# EasyEDA Pro project PID项目.eprj

# Schematic PID项目
Board Name: PID项目; Create Date: 2025-08-23
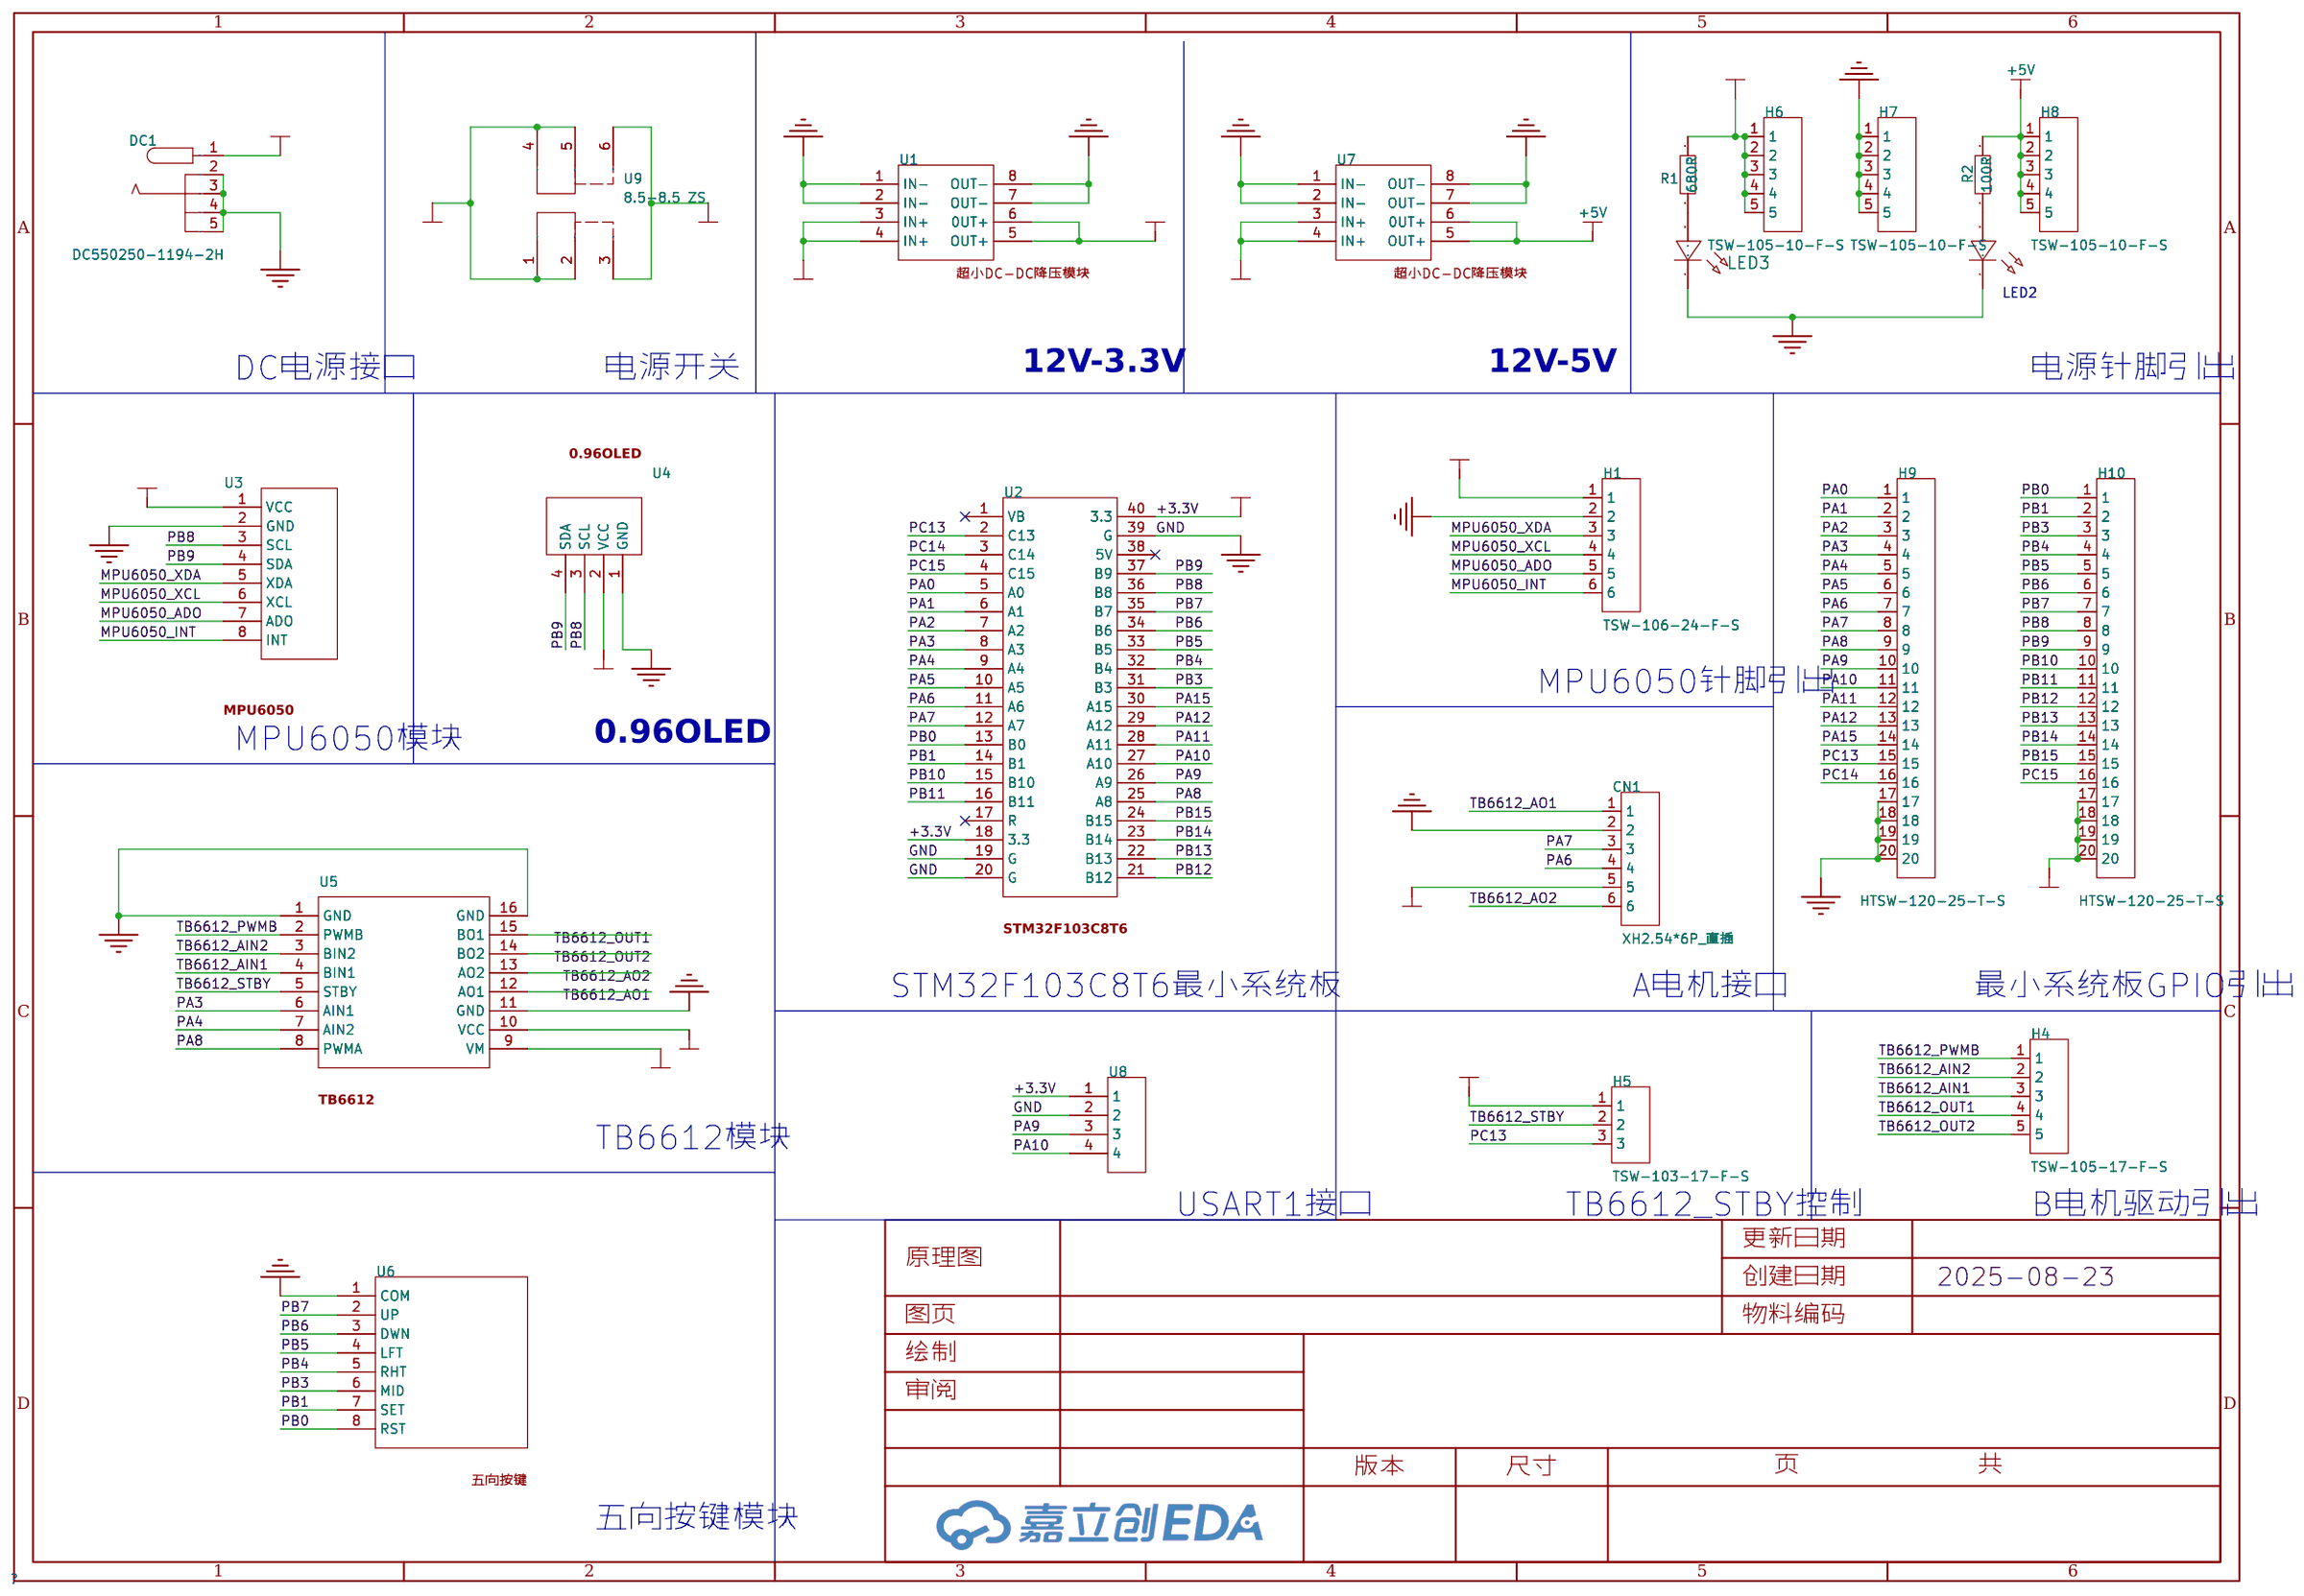
[diagram p0: schematic sheet]

## Parts
CN1  XH2.54*6P_直插  [CONN-TH_XH2.54-6P]
DC1  DC550250-1194-2H  [DC-IN-TH_DC550250-1194-2H]
H1  TSW-106-24-F-S  [HDR-TH_MTSW-106-07-L-S-220]
H4  TSW-105-17-F-S  [HDR-TH_5P-P2.54_HTSW-105-08-F-S]
H5  TSW-103-17-F-S  [HDR-TH_3P-P2.54_HTSW-103-14-TM-S]
H6  TSW-105-10-F-S  [HDR-TH_5P-P2.54_HTSW-105-08-F-S]
H7  TSW-105-10-F-S  [HDR-TH_5P-P2.54_HTSW-105-08-F-S]
H8  TSW-105-10-F-S  [HDR-TH_5P-P2.54_HTSW-105-08-F-S]
H9  HTSW-120-25-T-S  [HDR-TH_TSW-120-22-L-S]
H10  HTSW-120-25-T-S  [HDR-TH_TSW-120-22-L-S]
LED2  -  [LED_0805]
LED3  -  [LED_0805]
R1  680R  [R0805]
R2  100R  [R0805]
U1  -  [12V-3.3V]
U2  -  [F103C8T6]
U3  -  [MPU6050]
U4  -  [0.96OLED]
U5  -  [电机驱动]
U6  -  [五向按键]
U7  -  [12V-3.3V]
U8  -  [1x4]
U9  8.5-8.5 ZS  [SW-TH_6P-L8.5-W8.5-P2.50_8.5-8.5-ZS]

## Library data of the parts
CN1 = XH2.54*6P_直插: Supplier Part: C9900008614; Supplier Footprint: XH2.54_6P; JLCPCB Part Class: 扩展库; Supplier: LCSC
DC1 = DC550250-1194-2H: Supplier Part: C7428742; Manufacturer: HDGC(华德共创); Supplier Footprint: SMD; Datasheet: https://item.szlcsc.com/datasheet/DC550250-1194-2H/8424489.html; Supplier: LCSC; Connector Type: DC电源插座
H1 = TSW-106-24-F-S: LCSC Part Name: 间距:2.54mm 直插; Supplier Part: C7366187; Manufacturer: SAMTEC; Supplier Footprint: 插件,P=2.54mm; JLCPCB Part Class: 扩展库; Datasheet: https://item.szlcsc.com/datasheet/TSW-106-24-F-S/8337024.html; Supplier: LCSC; Pitch: 2.54mm; Mounting Type: 直插; Number of Rows: 单排; Number of Pins: 6P; Contact Material: 磷青铜; Contact Plating: 锡; Operating Temperature: -55℃~+125℃; Color: 黑色
H4 = TSW-105-17-F-S: LCSC Part Name: 间距:2.54mm 直插; Supplier Part: C7366066; Manufacturer: SAMTEC; Supplier Footprint: 插件,P=2.54mm; JLCPCB Part Class: 扩展库; Datasheet: https://item.szlcsc.com/datasheet/TSW-105-17-F-S/8336902.html; Supplier: LCSC; Pitch: 2.54mm; Mounting Type: 直插; Number of Rows: 单排; Number of Pins: 5P; Contact Material: 磷青铜; Contact Plating: 锡; Operating Temperature: -55℃~+125℃; Color: 黑色
H5 = TSW-103-17-F-S: LCSC Part Name: 间距:2.54mm 直插; Supplier Part: C6561475; Manufacturer: SAMTEC; Supplier Footprint: 插件,P=2.54mm; JLCPCB Part Class: 扩展库; Datasheet: https://item.szlcsc.com/datasheet/TSW-103-17-F-S/7515405.html; Supplier: LCSC; Pitch: 2.54mm; Mounting Type: 直插; Number of Rows: 单排; Number of Pins: 3P; Contact Material: 磷青铜; Contact Plating: 锡; Operating Temperature: -55℃~+125℃; Color: 黑色
H6-H8 = TSW-105-10-F-S: LCSC Part Name: 间距:2.54mm 直插; Supplier Part: C7128842; Manufacturer: SAMTEC; Supplier Footprint: 插件,P=2.54mm; JLCPCB Part Class: 扩展库; Datasheet: https://item.szlcsc.com/datasheet/TSW-105-10-F-S/8095648.html; Supplier: LCSC; Pitch: 2.54mm; Mounting Type: 直插; Number of Rows: 单排; Number of Pins: 5P; Contact Material: 磷青铜; Contact Plating: 锡; Operating Temperature: -55℃~+125℃; Color: 黑色
H9 H10 = HTSW-120-25-T-S: LCSC Part Name: 间距:2.54mm 直插; Supplier Part: C6637971; Manufacturer: SAMTEC; Supplier Footprint: 插件,P=2.54mm; JLCPCB Part Class: 扩展库; Datasheet: https://item.szlcsc.com/datasheet/HTSW-120-25-T-S/7592945.html; Supplier: LCSC; Pitch: 2.54mm; Mounting Type: 直插; Number of Rows: 单排; Number of Pins: 20P; Contact Material: 磷青铜; Contact Plating: 锡; Operating Temperature: -55℃~+105℃
LED2 = LED_0805-G: Supplier Footprint: 0805
LED3 = LED_0805-R: Supplier Footprint: 0805
R1 R2 = Res_0805: Supplier Footprint: 0805
U1 U7 = 12V-3.3V
U2 = f103c8t6
U3 = MPU6050
U4 = 0.96OLED
U5 = 电机驱动
U6 = 五向按键
U8 = 1x4
U9 = 8.5-8.5 ZS: LCSC Part Name: 按键开关8.5x8.5 自锁高头 180gf; Supplier Part: C5379895; Manufacturer: SHOU HAN(首韩); Supplier Footprint: 插件; JLCPCB Part Class: 扩展库; Datasheet: https://atta.szlcsc.com/upload/public/pdf/source/20250421/740778E17D84A853554121E0B172E787.pdf; Supplier: LCSC; Circuit: 双刀双掷; Self Lock / No Lock: 自锁; Actuator Style: 矩形柱塞; Mounting Type: 直插; Contact Current: 100mA; Voltage Rating: 30V; Actuator/Cap Color: 蓝色; With Lamp: 不带; Termination Style: PC引脚; Operating Force: 1.8N; Operating Temperature: -10℃~+70℃; Life: 5千次

## Nets
+3.3V: CN1.5 H1.1 H5.1 H10.17 H10.18 H10.19 H10.20 U1.5(OUT+) U1.6(0UT+) U2.18(3.3) U2.40(3.3) U3.1(VCC) U4.2(VCC) U5.10(VCC) U8.1
+5V: H8.1 H8.2 H8.3 H8.4 H8.5 R2.2 U7.5(OUT+) U7.6(0UT+)
+12V: H6.1 H6.2 H6.3 H6.4 H6.5 R1.1 U1.3(IN+) U1.4(IN+) U5.9(VM) U7.3(IN+) U7.4(IN+) U9.3 U9.6
GND: CN1.2 DC1.2(-) DC1.3(-) DC1.4(-) DC1.5(-) H1.2 H7.1 H7.2 H7.3 H7.4 H7.5 H9.17 H9.18 H9.19 H9.20 LED2.1(C) LED3.1(C) U1.1(IN-) U1.2(IN-) U1.7(OUT-) U1.8(OUT-) U2.19(G) U2.20(G) U2.39(G) U3.2(GND) U4.1(GND) U5.1(GND) U5.11(GND) U5.16(GND) U6.1(COM) U7.1(IN-) U7.2(IN-) U7.7(OUT-) U7.8(OUT-) U8.2
IN+12V: DC1.1(+) U9.1 U9.2 U9.4 U9.5
MPU6050_ADO: H1.5 U3.7(ADO)
MPU6050_INT: H1.6 U3.8(INT)
MPU6050_XCL: H1.4 U3.6(XCL)
MPU6050_XDA: H1.3 U3.5(XDA)
PA0: H9.1 U2.5(A0)
PA1: H9.2 U2.6(A1)
PA2: H9.3 U2.7(A2)
PA3: H9.4 U2.8(A3) U5.6(AIN1)
PA4: H9.5 U2.9(A4) U5.7(AIN2)
PA5: H9.6 U2.10(A5)
PA6: CN1.4 H9.7 U2.11(A6)
PA7: CN1.3 H9.8 U2.12(A7)
PA8: H9.9 U2.25(A8) U5.8(PWMA)
PA9: H9.10 U2.26(A9) U8.3
PA10: H9.11 U2.27(A10) U8.4
PA11: H9.12 U2.28(A11)
PA12: H9.13 U2.29(A12)
PA15: H9.14 U2.30(A15)
PB0: H10.1 U2.13(B0) U6.8(RST)
PB1: H10.2 U2.14(B1) U6.7(SET)
PB3: H10.3 U2.31(B3) U6.6(MID)
PB4: H10.4 U2.32(B4) U6.5(RHT)
PB5: H10.5 U2.33(B5) U6.4(LFT)
PB6: H10.6 U2.34(B6) U6.3(DWN)
PB7: H10.7 U2.35(B7) U6.2(UP)
PB8: H10.8 U2.36(B8) U3.3(SCL) U4.3(SCL)
PB9: H10.9 U2.37(B9) U3.4(SDA) U4.4(SDA)
PB10: H10.10 U2.15(B10)
PB11: H10.11 U2.16(B11)
PB12: H10.12 U2.21(B12)
PB13: H10.13 U2.22(B13)
PB14: H10.14 U2.23(B14)
PB15: H10.15 U2.24(B15)
PC13: H5.3 H9.15 U2.2(C13)
PC14: H9.16 U2.3(C14)
PC15: H10.16 U2.4(C15)
TB6612_AIN1: H4.3 U5.4(BIN1)
TB6612_AIN2: H4.2 U5.3(BIN2)
TB6612_AO1: CN1.1 U5.12(AO1)
TB6612_AO2: CN1.6 U5.13(AO2)
TB6612_OUT1: H4.4 U5.15(BO1)
TB6612_OUT2: H4.5 U5.14(BO2)
TB6612_PWMB: H4.1 U5.2(PWMB)
TB6612_STBY: H5.2 U5.5(STBY)
$1N9714: LED2.2(A) R2.1
$1N10386: LED3.2(A) R1.2

Not connected (* = marked no-connect by the designer): U2 1(VB)* 17(R)* 38(5V)*

## Notes on the sheet
- DC电源接口
- 电源开关
- 12V-3.3V
- 12V-5V
- 电源针脚引出
- MPU6050针脚引出
- MPU6050模块
- 0.96OLED
- STM32F103C8T6最小系统板
- A电机接口
- 最小系统板GPIO引出
- TB6612模块
- USART1接口
- TB6612_STBY控制
- B电机驱动引出
- 五向按键模块

# Board PID项目
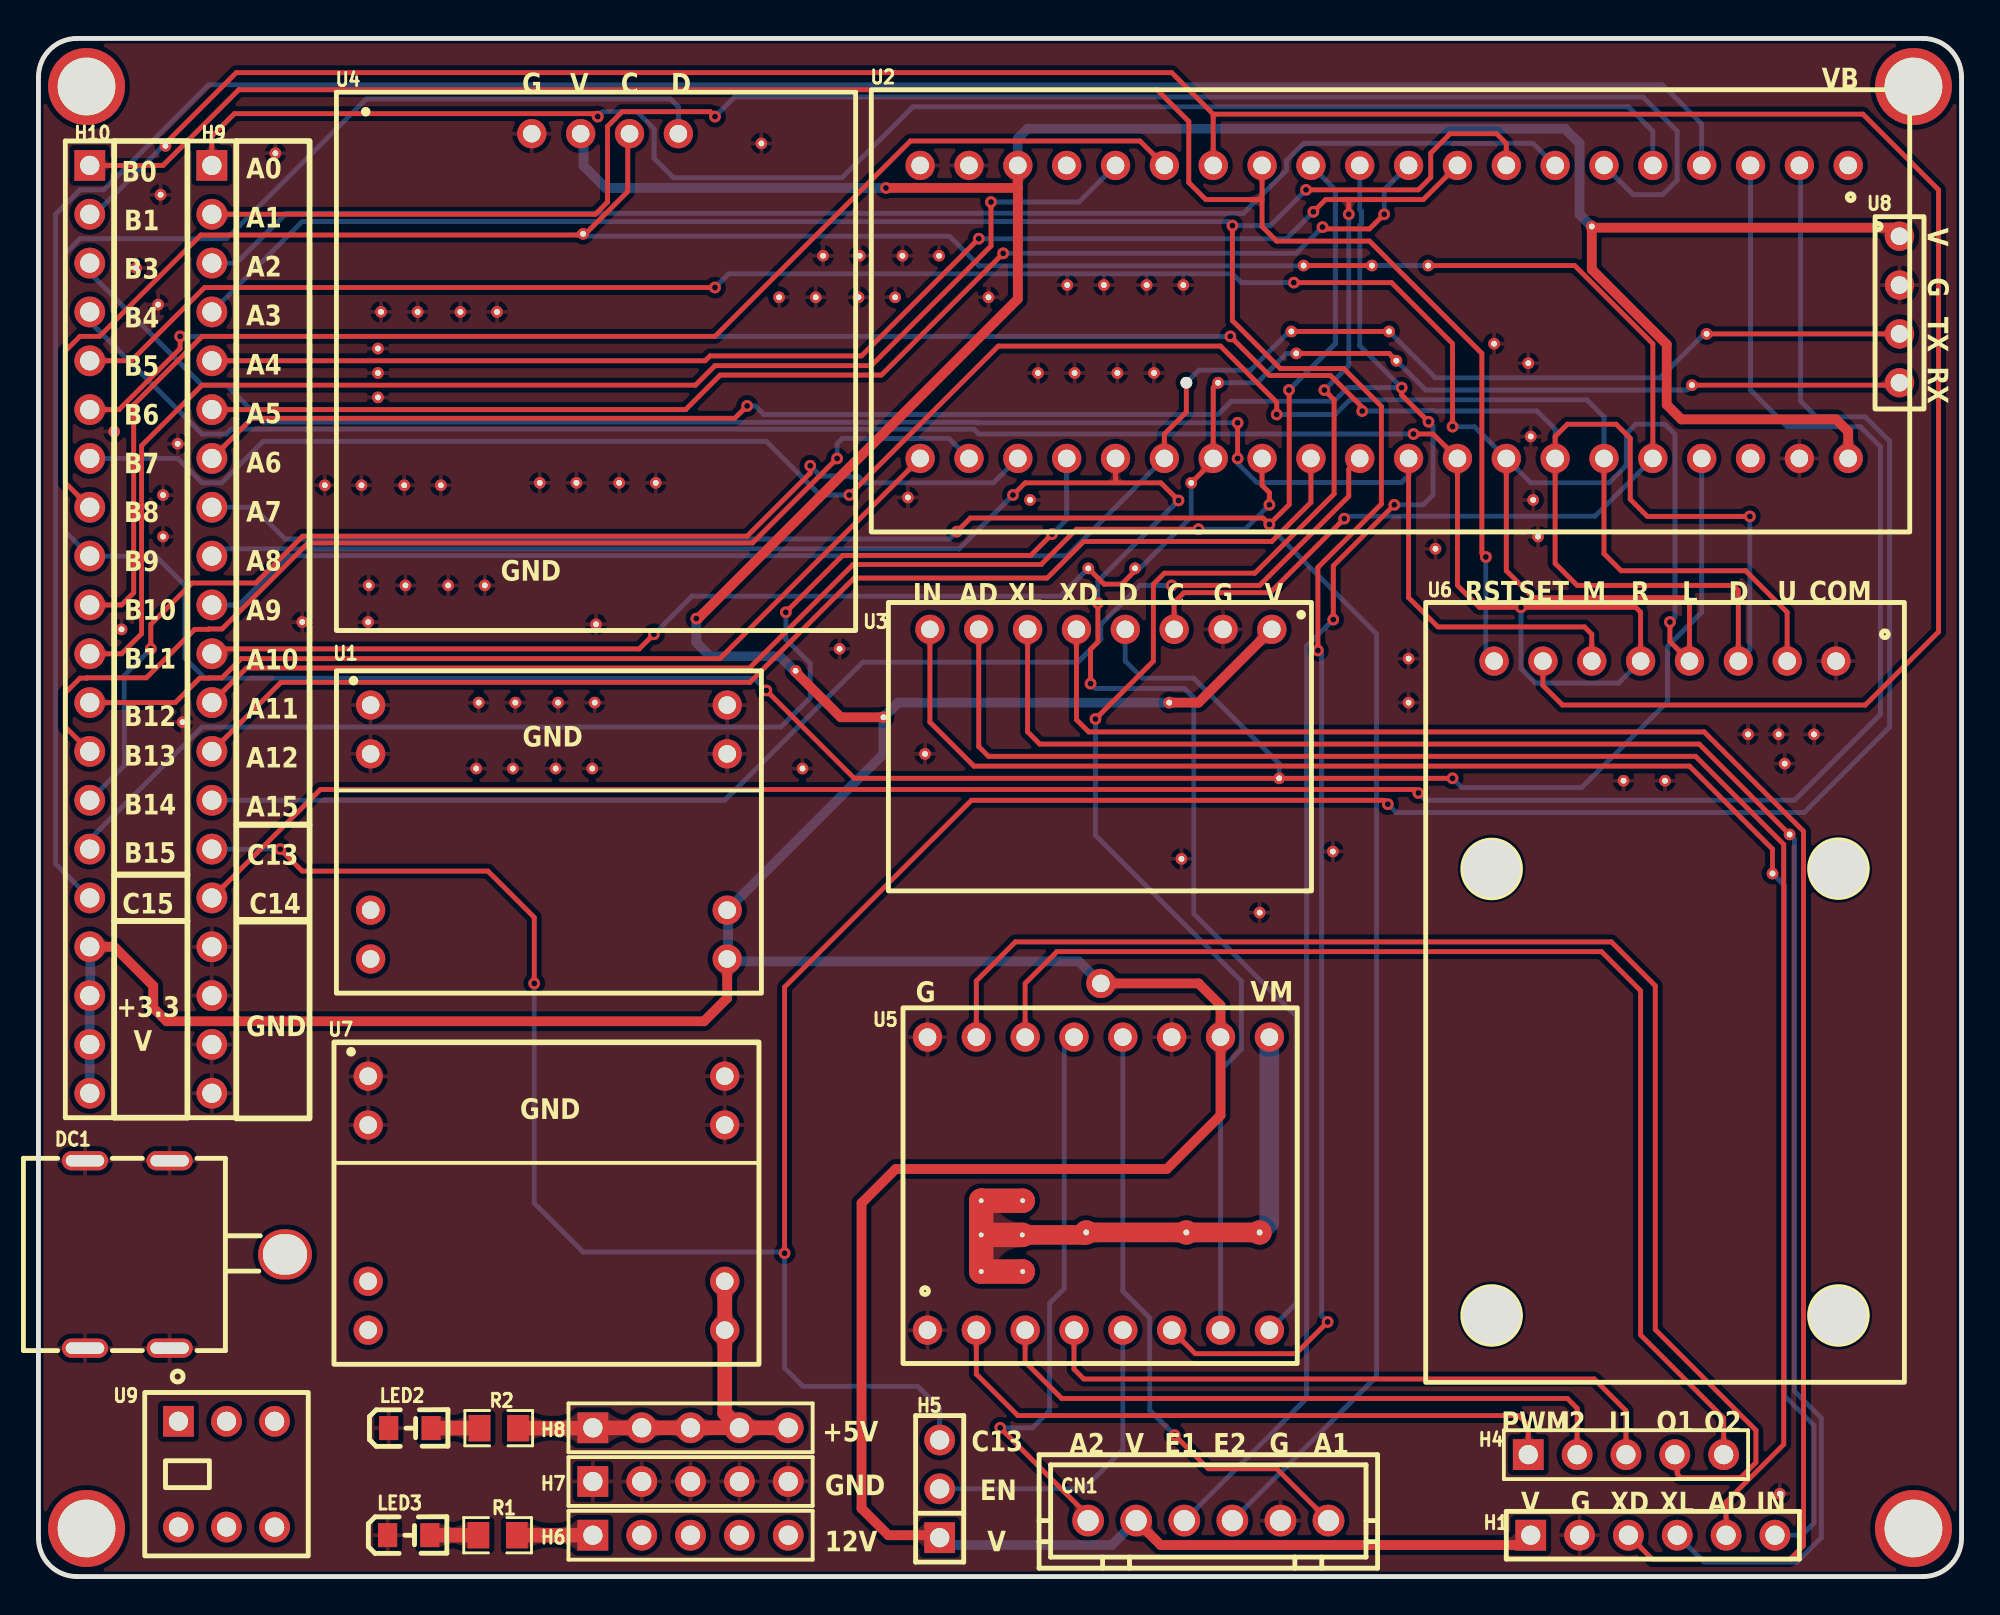
[diagram p1: board, top side]
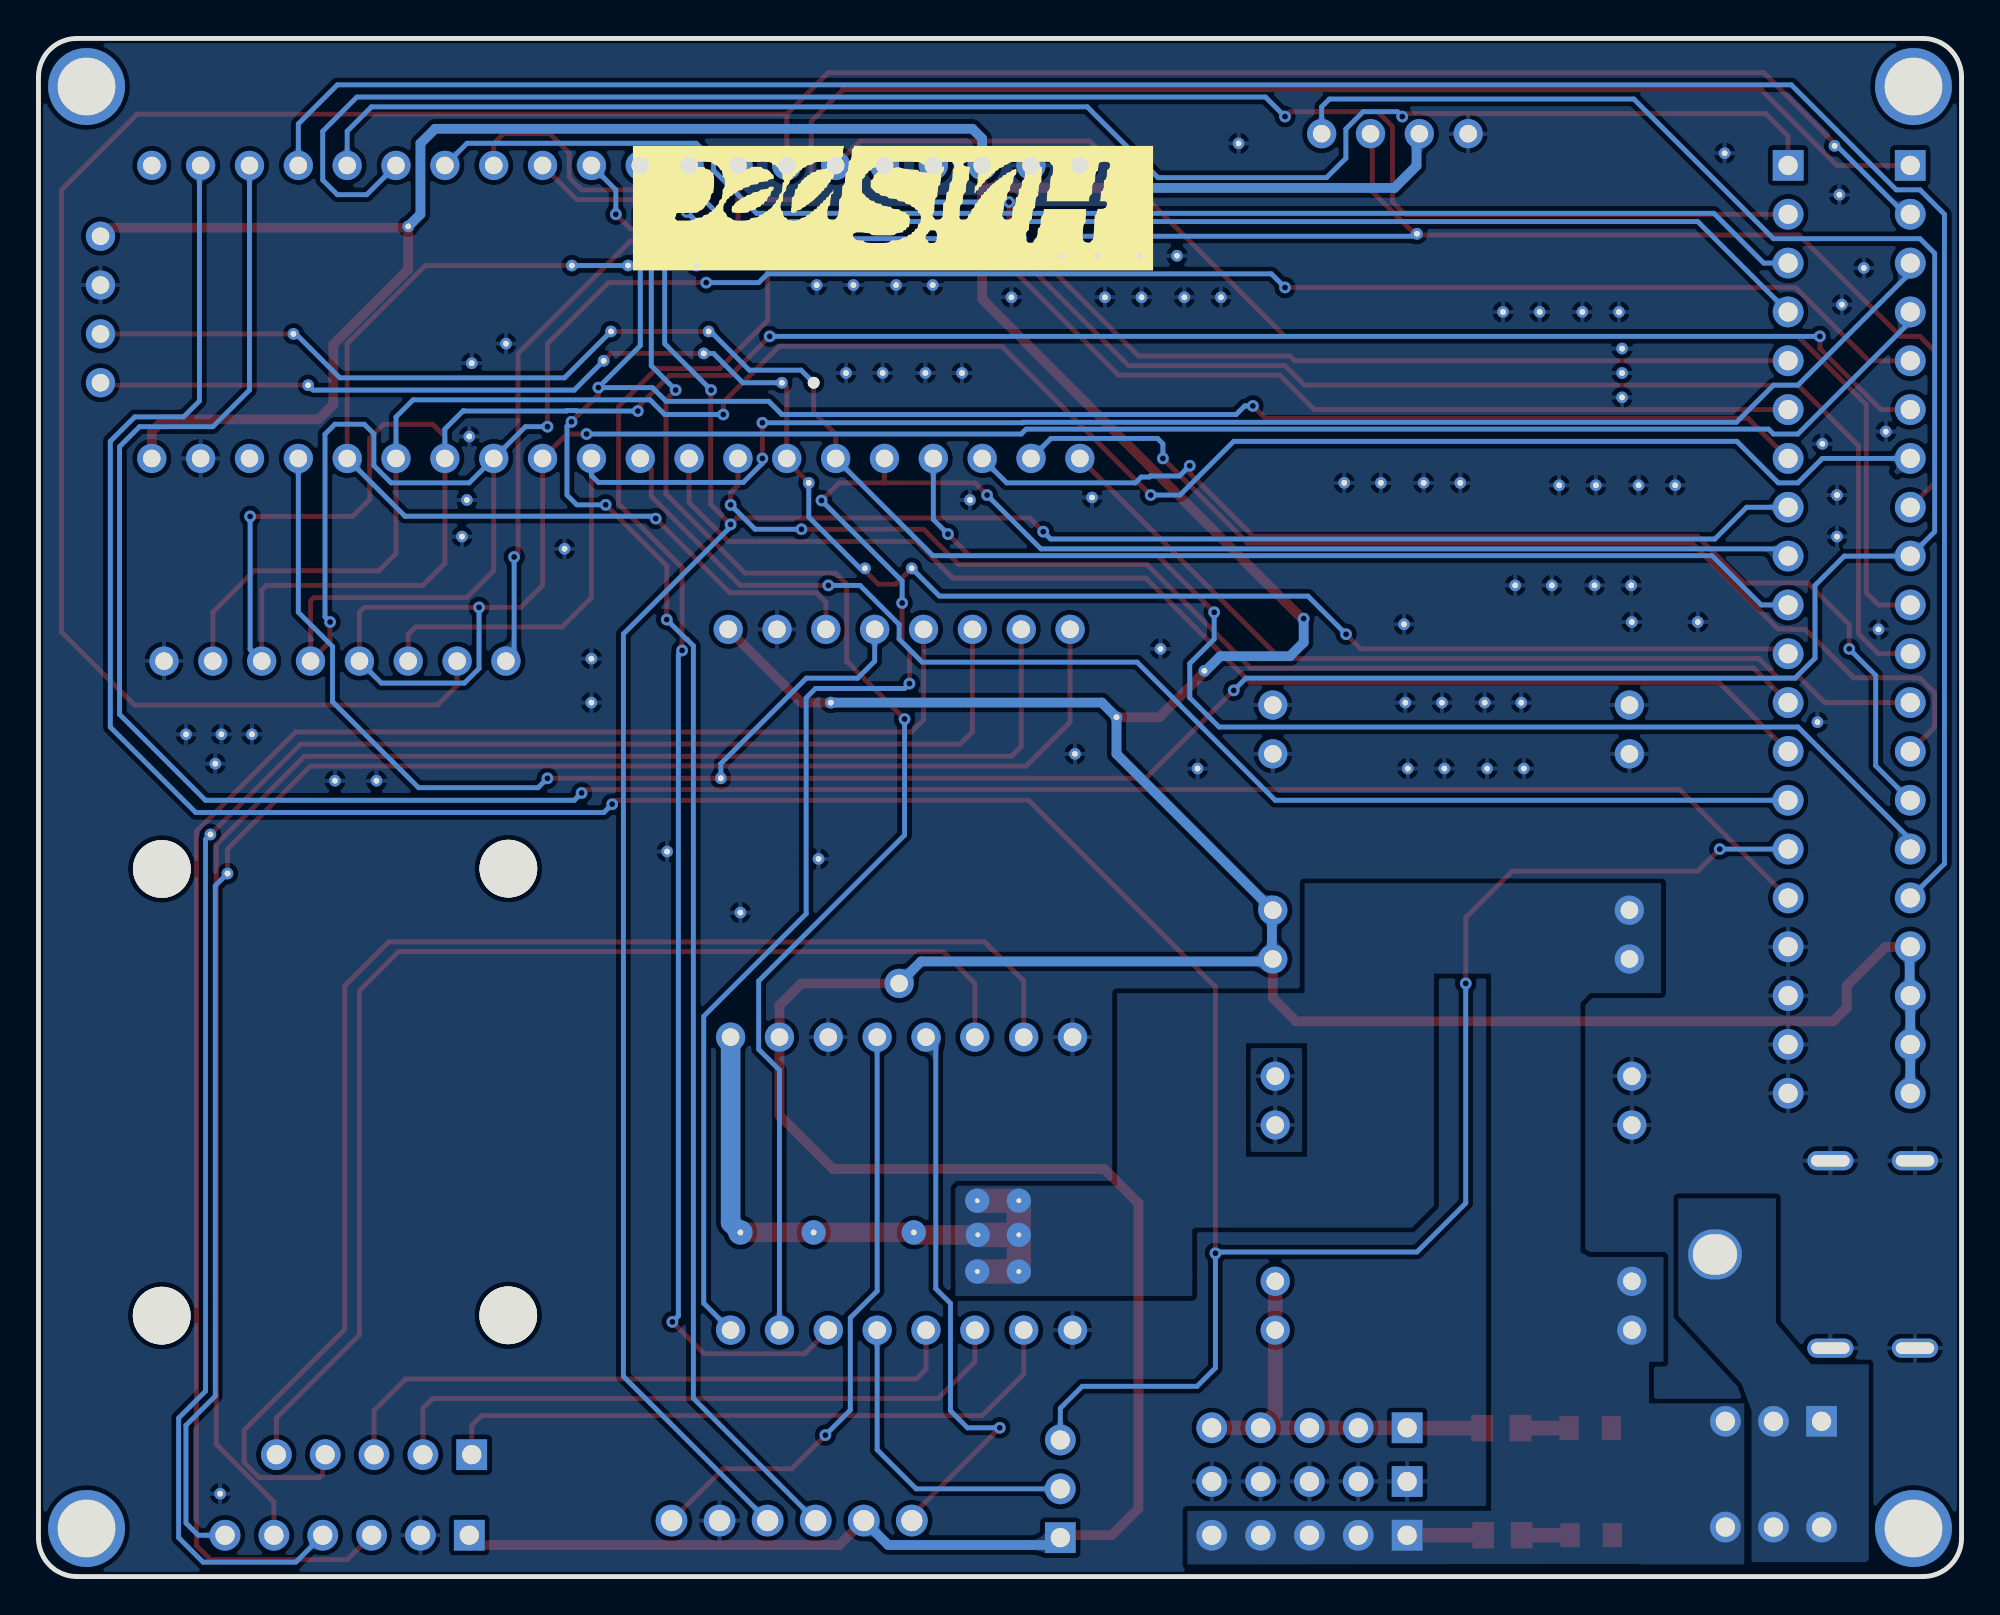
[diagram p2: board, bottom side, seen from below]

Outline 100 x 80 mm; copper layers: Top Layer, Bottom Layer. Coordinates in mm from the lower left corner of the outline.
Outline path: 0,78 0,2 arc(0.59,0.59) 2,0 98,0 arc(99.41,0.59) 100,2 100,78 arc(99.41,79.41) 98,80 2,80 arc(0.59,79.41) 0,78
Stack: Top Layer 0.035mm / Dielectric1 1.51mm FR4 er 4.5 / Bottom Layer 0.035mm

## Design rules (mm)
template: JLCPCB Capability(Two Layers Board)
spacing copperThickness1oz (default): track to track 0.102, other pairs 0.152 to 0.3
spacing copperThickness2oz: track to track 0.203, other pairs 0.152 to 0.3
track width copperThickness1oz (default): min 0.127, default 0.254, max 2.54
track width copperThickness2oz: min 0.203, default 0.254, max 2.54
differential pair differentialPair (default): width min 0.127, default 0.254, max 2.54; gap min 0.152, default 0.152
via viaSize (default): diameter min 0.5, default 0.61, max 10; hole min 0.3, default 0.305, max 6.3

## Placement (name value [footprint] x y rotation side)
CN1  XH2.54*6P_直插  [CONN-TH_XH2.54-6P]  60.83 2.91 180 top
DC1  DC550250-1194-2H  [DC-IN-TH_DC550250-1194-2H]  7.62 16.75 270 top
H1  TSW-106-24-F-S  [HDR-TH_MTSW-106-07-L-S-220]  83.95 2.15 0 top
H4  TSW-105-17-F-S  [HDR-TH_5P-P2.54_HTSW-105-08-F-S]  82.55 6.34 0 top
H5  TSW-103-17-F-S  [HDR-TH_3P-P2.54_HTSW-103-14-TM-S]  46.86 4.56 90 top
H6  TSW-105-10-F-S  [HDR-TH_5P-P2.54_HTSW-105-08-F-S]  33.91 2.15 0 top
H7  TSW-105-10-F-S  [HDR-TH_5P-P2.54_HTSW-105-08-F-S]  33.91 4.94 0 top
H8  TSW-105-10-F-S  [HDR-TH_5P-P2.54_HTSW-105-08-F-S]  33.91 7.74 0 top
H9  HTSW-120-25-T-S  [HDR-TH_TSW-120-22-L-S]  9.02 49.27 270 top
H10  HTSW-120-25-T-S  [HDR-TH_TSW-120-22-L-S]  2.67 49.27 270 top
LED2  -  [LED_0805]  19.36 7.72 0 top
LED3  -  [LED_0805]  19.3 2.15 0 top
NOREF  -  [Pad_e9899]  59.53 67.17 0 top
NOREF#2  -  [Pad_e9882]  19.02 56.76 0 top
NOREF#3  -  [Pad_e9880]  14.89 56.76 0 top
NOREF#4  -  [Pad_e20482]  7.24 58.92 0 top
NOREF#5  -  [Pad_e14452]  6.22 66.16 0 top
NOREF#6  -  [Pad_e739]  57.02 52.44 0 top
NOREF#7  -  [Pad_e9898]  56.1 62.6 0 top
NOREF#8  -  [Pad_e9912]  17.18 51.55 0 top
NOREF#9  -  [Pad_e12298]  90.81 42.28 0 top
NOREF#10  -  [Pad_e9887]  32.1 56.89 0 top
NOREF#11  -  [Pad_e15623]  72.64 53.46 0 top
NOREF#12  -  [Pad_e9895]  58.01 62.6 0 top
NOREF#13  -  [Pad_e10920]  17.14 49.65 0 top
NOREF#14  -  [Pad_e9881]  16.8 56.76 0 top
NOREF#15  -  [Pad_e1639]  6.6 74.41 0 top
NOREF#16  -  [Pad_e12295]  88.9 43.81 0 top
NOREF#17  -  [Pad_e1501]  91.06 38.6 90 top
NOREF#18  -  [Pad_e10925]  6.48 54.09 0 top
NOREF#19  -  [Pad_e9890]  30.19 56.89 0 top
NOREF#20  -  [Pad_e32]  97.5 2.5 0 top
NOREF#21  -  [Pad_e9905]  42.7 68.7 0 top
NOREF#22  -  [Pad_e987]  59.69 62.09 0 top
NOREF#23  -  [Pad_e13483]  17.65 62.6 0 top
NOREF#24  -  [Pad_e1355]  51.18 15.87 0 top
NOREF#25  -  [Pad_e19066]  24.67 42.03 0 top
NOREF#26  -  [Pad_e1357]  49.02 19.55 0 top
NOREF#27  -  [Pad_e10919]  28.99 49.53 0 top
NOREF#28  -  [Pad_e12299]  82.42 41.39 0 top
NOREF#29  -  [Pad_e13026]  59.69 17.9 0 top
NOREF#30  -  [Pad_e12340]  6.48 56.25 0 top
NOREF#31  -  [Pad_e1361]  49.02 17.77 0 top
NOREF#32  -  [Pad_e255]  64.52 41.52 0 top
NOREF#33  -  [Pad_e9910]  42.64 66.54 0 top
NOREF#34  -  [Pad_e15620]  77.6 59.3 0 top
NOREF#35  -  [Pad_e1344]  51.16 17.77 0 top
NOREF#36  -  [Pad_e19065]  28.92 45.46 0 top
NOREF#37  -  [Pad_e665]  28.32 69.84 0 top
NOREF#38  -  [Pad_e8785]  80.77 70.22 0 top
NOREF#39  -  [Pad_e401]  43.94 44.69 0 top
NOREF#40  -  [Pad_e15499]  75.57 13.59 0 top
NOREF#41  -  [Pad_e13484]  17.65 63.87 0 top
NOREF#42  -  [Pad_e405]  58.8 45.46 0 top
NOREF#43  -  [Pad_e9891]  23.84 65.78 0 top
NOREF#44  -  [Pad_e9901]  55.4 67.17 0 top
NOREF#45  -  [Pad_e9902]  57.63 67.17 0 top
NOREF#46  -  [Pad_e19063]  22.89 45.46 0 top
NOREF#47  -  [Pad_e13025]  63.5 17.9 0 top
NOREF#48  -  [Pad_e9903]  46.83 68.7 0 top
NOREF#49  -  [Pad_e1534]  90.17 36.57 0 top
NOREF#50  -  [Pad_e9896]  51.97 62.6 0 top
NOREF#51  -  [Pad_e9888]  26.07 56.89 0 top
NOREF#52  -  [Pad_e11115]  46.1 42.79 0 top
NOREF#53  -  [Pad_e10927]  4.32 49.27 0 top
NOREF#54  -  [Pad_e19069]  28.8 42.03 0 top
NOREF#55  -  [Pad_e1159]  65.41 63.62 0 top
NOREF#56  -  [Pad_e10258]  51.56 56 0 top
NOREF#57  -  [Pad_e9909]  40.42 66.54 0 top
NOREF#58  -  [Pad_e7684]  39.37 47.11 0 top
NOREF#59  -  [Pad_e15496]  75.56 36.82 0 top
NOREF#60  -  [Pad_e1177]  85.98 61.97 0 top
NOREF#61  -  [Pad_e15622]  77.72 56 0 top
NOREF#62  -  [Pad_e9907]  44.55 66.54 0 top
NOREF#63  -  [Pad_e15587]  49.4 66.54 0 top
NOREF#64  -  [Pad_e15498]  93.59 36.8 0 top
NOREF#65  -  [Pad_e9904]  40.8 68.7 0 top
NOREF#66  -  [Pad_e13482]  17.65 61.33 0 top
NOREF#67  -  [Pad_e10930]  6.35 71.87 0 top
NOREF#68  -  [Pad_e9900]  53.5 67.17 0 top
NOREF#69  -  [Pad_e1164]  70.61 63.24 0 top
NOREF#70  -  [Pad_e8475]  55.25 30.85 0 top
NOREF#71  -  [Pad_e33]  2.5 2.5 0 top
NOREF#72  -  [Pad_e30]  2.5 77.5 0 top
NOREF#73  -  [Pad_e1350]  51.18 19.55 0 top
NOREF#74  -  [Pad_e10126]  39.73 42.03 0 top
NOREF#75  -  [Pad_e9893]  19.72 65.78 0 top
NOREF#76  -  [Pad_e731]  59.94 56.89 0 top
NOREF#77  -  [Pad_e19064]  27.02 45.46 0 top
NOREF#78  -  [Pad_e12300]  84.58 41.39 0 top
NOREF#79  -  [Pad_e10928]  5.08 68.06 0 top
NOREF#80  -  [Pad_e18997]  90.55 4.31 0 top
NOREF#81  -  [Pad_e13481]  41.66 48.25 0 top
NOREF#82  -  [Pad_e9894]  21.94 65.78 0 top
NOREF#83  -  [Pad_e1060]  86.74 64.63 0 top
NOREF#84  -  [Pad_e12296]  90.49 43.81 0 top
NOREF#85  -  [Pad_e1054]  70.23 64.76 0 top
NOREF#86  -  [Pad_e17595]  13.72 49.65 0 top
NOREF#87  -  [Pad_e31]  97.5 77.5 0 top
NOREF#88  -  [Pad_e9906]  44.93 68.7 0 top
NOREF#89  -  [Pad_e12302]  71.25 47.74 0 top
NOREF#90  -  [Pad_e19062]  24.8 45.46 0 top
NOREF#91  -  [Pad_e15500]  93.59 13.57 0 top
NOREF#92  -  [Pad_e10931]  12.32 74.03 0 top
NOREF#93  -  [Pad_e637]  69.34 68.19 0 top
NOREF#94  -  [Pad_e9879]  20.92 56.76 0 top
NOREF#95  -  [Pad_e992]  61.34 62.09 0 top
NOREF#96  -  [Pad_e9914]  21.3 51.55 0 top
NOREF#97  -  [Pad_e15619]  77.47 63.11 0 top
NOREF#98  -  [Pad_e15621]  77.98 54.09 0 top
NOREF#99  -  [Pad_e20484]  7.49 44.44 0 top
NOREF#100  -  [Pad_e9897]  53.88 62.6 0 top
NOREF#101  -  [Pad_e12303]  71.25 45.46 0 top
NOREF#102  -  [Pad_e10922]  63.5 34.53 0 top
NOREF#103  -  [Pad_e643]  65.79 68.19 0 top
NOREF#104  -  [Pad_e20483]  3.94 59.55 0 top
NOREF#105  -  [Pad_e1356]  49.02 15.87 0 top
NOREF#106  -  [Pad_e9892]  17.81 65.78 0 top
NOREF#107  -  [Pad_e15618]  75.69 64.12 0 top
NOREF#108  -  [Pad_e12297]  92.33 43.81 0 top
NOREF#109  -  [Pad_e10923]  67.31 37.71 0 top
NOREF#110  -  [Pad_e1049]  65.15 64.76 0 top
NOREF#111  -  [Pad_e9913]  19.08 51.55 0 top
NOREF#112  -  [Pad_e9889]  27.97 56.89 0 top
NOREF#113  -  [Pad_e19068]  26.89 42.03 0 top
NOREF#114  -  [Pad_e744]  54.59 52.44 0 top
NOREF#115  -  [Pad_e502]  72.26 68.19 0 top
NOREF#116  -  [Pad_e13027]  54.48 17.9 0 top
NOREF#117  -  [Pad_e10921]  59.44 37.33 0 top
NOREF#118  -  [Pad_e10924]  45.21 56.12 0 top
NOREF#119  -  [Pad_e19067]  22.77 42.03 0 top
NOREF#120  -  [Pad_e9908]  38.51 66.54 0 top
NOREF#121  -  [Pad_e9911]  23.21 51.55 0 top
NOREF#122  -  [Pad_e4681]  37.59 74.54 0 top
R1  680R  [R0805]  23.88 2.15 180 top
R2  100R  [R0805]  23.93 7.72 0 top
U1  -  [12V-3.3V]  26.54 38.72 0 top
U2  -  [F103C8T6]  68.2 67.43 0 top
U3  -  [MPU6050]  46.1 49.27 0 top
U4  -  [0.96OLED]  29.46 71.36 0 top
U5  -  [电机驱动]  45.97 27.8 0 top
U6  -  [五向按键]  86.23 42.53 270 top
U7  -  [12V-3.3V]  26.42 19.42 0 top
U8  -  [1x4]  96.77 69.33 0 top
U9  8.5-8.5 ZS  [SW-TH_6P-L8.5-W8.5-P2.50_8.5-8.5-ZS]  9.78 5.32 180 top

## Footprints (pads in the part's own frame, mm; a bottom-side part is the same pattern mirrored in y, then rotated)
0.96OLED
  round 1.524 hole 0.914: 1(-3.81,3.683) 2(-1.27,3.683) 3(1.27,3.683) 4(3.81,3.683)
1x4
  round 1.524 hole 0.914: 1(0,0.381) 2(0,-2.159) 3(0,-4.699) 4(0,-7.239)
12V-3.3V
  round 1.524 hole 0.914: 1(-9.271,6.604) 2(-9.271,4.064) 3(-9.271,-4.064) 4(-9.271,-6.604) 5(9.271,-6.604) 6(9.271,-4.064) 7(9.271,4.064) 8(9.271,6.604)
CONN-TH_XH2.54-6P
  round 1.65 hole 1.1: 1(-6.25,0) 2(-3.75,0) 3(-1.25,0) 4(1.25,0) 5(3.75,0) 6(6.25,0)
DC-IN-TH_DC550250-1194-2H
  oval 2.6x2.8 hole 2.1x2.3: 1(0,5.2)
  oval 1x2.4 hole 0.6x2: 2(-4.875,-0.8) 3(4.875,-0.8) 4(-4.875,-5.2) 5(4.875,-5.2)
F103C8T6
  round 1.524 hole 0.914: 1(25.908,5.969) 2(23.368,5.969) 3(20.828,5.969) 4(18.288,5.969) 5(15.748,5.969) 6(13.208,5.969) 7(10.668,5.969) 8(8.128,5.969) 9(5.588,5.969) 10(3.048,5.969) 11(0.508,5.969) 12(-2.032,5.969) 13(-4.572,5.969) 14(-7.112,5.969) 15(-9.652,5.969) 16(-12.192,5.969) 17(-14.732,5.969) 18(-17.272,5.969) 19(-19.812,5.969) 20(-22.352,5.969) 21(-22.352,-9.271) 22(-19.812,-9.271) 23(-17.272,-9.271) 24(-14.732,-9.271) 25(-12.192,-9.271) 26(-9.652,-9.271) 27(-7.112,-9.271) 28(-4.572,-9.271) 29(-2.032,-9.271) 30(0.508,-9.271) 31(3.048,-9.271) 32(5.588,-9.271) 33(8.128,-9.271) 34(10.668,-9.271) 35(13.208,-9.271) 36(15.748,-9.271) 37(18.288,-9.271) 38(20.828,-9.271) 39(23.368,-9.271) 40(25.908,-9.271)
HDR-TH_3P-P2.54_HTSW-103-14-TM-S
  rect 1.6x1.6 hole 1: 1(-2.54,0)
  round 1.6 hole 1: 2(0,0) 3(2.54,0)
HDR-TH_5P-P2.54_HTSW-105-08-F-S
  rect 1.6x1.6 hole 1: 1(-5.08,0)
  round 1.6 hole 1: 2(-2.54,0) 3(0,0) 4(2.54,0) 5(5.08,0)
HDR-TH_MTSW-106-07-L-S-220
  rect 1.6x1.6 hole 1: 1(-6.35,0)
  round 1.6 hole 1: 2(-3.81,0) 3(-1.27,0) 4(1.27,0) 5(3.81,0) 6(6.35,0)
HDR-TH_TSW-120-22-L-S
  rect 1.6x1.6 hole 1: 1(-24.13,0)
  round 1.6 hole 1: 2(-21.59,0) 3(-19.05,0) 4(-16.51,0) 5(-13.97,0) 6(-11.43,0) 7(-8.89,0) 8(-6.35,0) 9(-3.81,0) 10(-1.27,0) 11(1.27,0) 12(3.81,0) 13(6.35,0) 14(8.89,0) 15(11.43,0) 16(13.97,0) 17(16.51,0) 18(19.05,0) 19(21.59,0) 20(24.13,0)
LED_0805
  rect 1x1.25 smd: 1(-1.15,0.005) 2(1.05,0.005)
MPU6050
  round 1.524 hole 0.914: 1(18.034,0) 2(15.494,0) 3(12.954,0) 4(10.414,0) 5(7.874,0) 6(5.334,0) 7(2.794,0) 8(0.254,0)
Pad_e30
  round 4 hole 3: 1(0,0)
Pad_e31
  round 4 hole 3: 2(0,0)
Pad_e32
  round 4 hole 3: 3(0,0)
Pad_e33
  round 4 hole 3: 4(0,0)
Pad_e255
  round 0.61 hole 0.305: 1(0,0)
Pad_e401
  round 0.61 hole 0.305: 2(0,0)
Pad_e405
  round 0.61 hole 0.305: 1(0,0)
Pad_e502
  round 0.61 hole 0.305: 1(0,0)
Pad_e637
  round 0.61 hole 0.305: 1(0,0)
Pad_e643
  round 0.61 hole 0.305: 1(0,0)
Pad_e665
  round 0.61 hole 0.305: 1(0,0)
Pad_e731
  round 0.61 hole 0.305: 1(0,0)
Pad_e739
  round 0.61 hole 0.305: 1(0,0)
Pad_e744
  round 0.61 hole 0.305: 3(0,0)
Pad_e987
  round 0.61 hole 0.914x0.305: 1(0,0)
Pad_e992
  round 0.61 hole 0.305: 1(0,0)
Pad_e1049
  round 0.61 hole 0.305: 1(0,0)
Pad_e1054
  round 0.61 hole 0.305: 1(0,0)
Pad_e1060
  round 0.61 hole 0.305: 1(0,0)
Pad_e1159
  round 0.61 hole 0.305: 1(0,0)
Pad_e1164
  round 0.61 hole 0.305: 1(0,0)
Pad_e1177
  round 0.61 hole 0.305: 1(0,0)
Pad_e1344
  round 1.27 hole 0.254: 1(0,0)
Pad_e1350
  round 1.27 hole 0.254: 2(0,0)
Pad_e1355
  round 1.27 hole 0.254: 3(0,0)
Pad_e1356
  round 1.27 hole 0.254: 4(0,0)
Pad_e1357
  round 1.27 hole 0.254: 5(0,0)
Pad_e1361
  round 1.27 hole 0.254: 1(0,0)
Pad_e1501
  round 0.61 hole 0.305: 1(0,0)
Pad_e1534
  round 0.61 hole 0.305: 1(0,0)
Pad_e1639
  round 0.61 hole 0.305: 1(0,0)
Pad_e4681
  round 0.61 hole 0.305: 1(0,0)
Pad_e7684
  round 0.61 hole 0.305: 1(0,0)
Pad_e8475
  round 1.524 hole 0.914: 1(0,0)
Pad_e8785
  round 0.61 hole 0.305: 1(0,0)
Pad_e9879
  round 0.61 hole 0.305: 1(0,0)
Pad_e9880
  round 0.61 hole 0.305: 1(0,0)
Pad_e9881
  round 0.61 hole 0.305: 1(0,0)
Pad_e9882
  round 0.61 hole 0.305: 1(0,0)
Pad_e9887
  round 0.61 hole 0.305: 1(0,0)
Pad_e9888
  round 0.61 hole 0.305: 1(0,0)
Pad_e9889
  round 0.61 hole 0.305: 1(0,0)
Pad_e9890
  round 0.61 hole 0.305: 1(0,0)
Pad_e9891
  round 0.61 hole 0.305: 1(0,0)
Pad_e9892
  round 0.61 hole 0.305: 1(0,0)
Pad_e9893
  round 0.61 hole 0.305: 1(0,0)
Pad_e9894
  round 0.61 hole 0.305: 1(0,0)
Pad_e9895
  round 0.61 hole 0.305: 1(0,0)
Pad_e9896
  round 0.61 hole 0.305: 1(0,0)
Pad_e9897
  round 0.61 hole 0.305: 1(0,0)
Pad_e9898
  round 0.61 hole 0.305: 1(0,0)
Pad_e9899
  round 0.61 hole 0.305: 1(0,0)
Pad_e9900
  round 0.61 hole 0.305: 1(0,0)
Pad_e9901
  round 0.61 hole 0.305: 1(0,0)
Pad_e9902
  round 0.61 hole 0.305: 1(0,0)
Pad_e9903
  round 0.61 hole 0.305: 1(0,0)
Pad_e9904
  round 0.61 hole 0.305: 1(0,0)
Pad_e9905
  round 0.61 hole 0.305: 1(0,0)
Pad_e9906
  round 0.61 hole 0.305: 1(0,0)
Pad_e9907
  round 0.61 hole 0.305: 1(0,0)
Pad_e9908
  round 0.61 hole 0.305: 1(0,0)
Pad_e9909
  round 0.61 hole 0.305: 1(0,0)
Pad_e9910
  round 0.61 hole 0.305: 1(0,0)
Pad_e9911
  round 0.61 hole 0.305: 1(0,0)
Pad_e9912
  round 0.61 hole 0.305: 1(0,0)
Pad_e9913
  round 0.61 hole 0.305: 1(0,0)
Pad_e9914
  round 0.61 hole 0.305: 1(0,0)
Pad_e10126
  round 0.61 hole 0.305: 1(0,0)
Pad_e10258
  round 0.61 hole 0.305: 1(0,0)
Pad_e10919
  round 0.61 hole 0.305: 1(0,0)
Pad_e10920
  round 0.61 hole 0.305: 1(0,0)
Pad_e10921
  round 0.61 hole 0.305: 1(0,0)
Pad_e10922
  round 0.61 hole 0.305: 1(0,0)
Pad_e10923
  round 0.61 hole 0.305: 1(0,0)
Pad_e10924
  round 0.61 hole 0.305: 1(0,0)
Pad_e10925
  round 0.61 hole 0.305: 1(0,0)
Pad_e10927
  round 0.61 hole 0.305: 1(0,0)
Pad_e10928
  round 0.61 hole 0.305: 1(0,0)
Pad_e10930
  round 0.61 hole 0.305: 1(0,0)
Pad_e10931
  round 0.61 hole 0.305: 1(0,0)
Pad_e11115
  round 0.61 hole 0.305: 1(0,0)
Pad_e12295
  round 0.61 hole 0.305: 1(0,0)
Pad_e12296
  round 0.61 hole 0.305: 2(0,0)
Pad_e12297
  round 0.61 hole 0.305: 3(0,0)
Pad_e12298
  round 0.61 hole 0.305: 4(0,0)
Pad_e12299
  round 0.61 hole 0.305: 5(0,0)
Pad_e12300
  round 0.61 hole 0.305: 6(0,0)
Pad_e12302
  round 0.61 hole 0.305: 8(0,0)
Pad_e12303
  round 0.61 hole 0.305: 9(0,0)
Pad_e12340
  round 0.61 hole 0.305: 1(0,0)
Pad_e13025
  round 1.27 hole 0.305: 1(0,0)
Pad_e13026
  round 1.27 hole 0.305: 2(0,0)
Pad_e13027
  round 1.27 hole 0.305: 3(0,0)
Pad_e13481
  round 0.61 hole 0.305: 1(0,0)
Pad_e13482
  round 0.61 hole 0.305: 1(0,0)
Pad_e13483
  round 0.61 hole 0.305: 1(0,0)
Pad_e13484
  round 0.61 hole 0.305: 1(0,0)
Pad_e14452
  round 0.61 hole 0.305: 1(0,0)
Pad_e15496
  round 3 hole 3: 1(0,0)
Pad_e15498
  round 3 hole 3: 1(0,0)
Pad_e15499
  round 3 hole 3: 1(0,0)
Pad_e15500
  round 3 hole 3: 1(0,0)
Pad_e15587
  round 0.61 hole 0.305: 1(0,0)
Pad_e15618
  round 0.61 hole 0.305: 1(0,0)
Pad_e15619
  round 0.61 hole 0.305: 2(0,0)
Pad_e15620
  round 0.61 hole 0.305: 3(0,0)
Pad_e15621
  round 0.61 hole 0.305: 4(0,0)
Pad_e15622
  round 0.61 hole 0.305: 5(0,0)
Pad_e15623
  round 0.61 hole 0.305: 6(0,0)
Pad_e17595
  round 0.61 hole 0.305: 1(0,0)
Pad_e18997
  round 0.61 hole 0.305: 1(0,0)
Pad_e19062
  round 0.61 hole 0.305: 1(0,0)
Pad_e19063
  round 0.61 hole 0.305: 1(0,0)
Pad_e19064
  round 0.61 hole 0.305: 1(0,0)
Pad_e19065
  round 0.61 hole 0.305: 1(0,0)
Pad_e19066
  round 0.61 hole 0.305: 1(0,0)
Pad_e19067
  round 0.61 hole 0.305: 1(0,0)
Pad_e19068
  round 0.61 hole 0.305: 1(0,0)
Pad_e19069
  round 0.61 hole 0.305: 1(0,0)
Pad_e20482
  round 0.61 hole 0.305: 1(0,0)
Pad_e20483
  round 0.61 hole 0.305: 2(0,0)
Pad_e20484
  round 0.61 hole 0.305: 3(0,0)
R0805
  rect 1.133x1.377 smd: 1(-1,0) 2(1,0)
SW-TH_6P-L8.5-W8.5-P2.50_8.5-8.5-ZS
  rect 1.6x1.6 hole 1: 1(2.5,-2.75)
  round 1.6 hole 1: 2(0,-2.75) 3(-2.5,-2.75) 4(2.5,2.75) 5(0,2.75) 6(-2.5,2.75)
五向按键
  round 1.524 hole 0.914: 1(-5.08,7.239) 2(-5.08,4.699) 3(-5.08,2.159) 4(-5.08,-0.381) 5(-5.08,-2.921) 6(-5.08,-5.461) 7(-5.08,-8.001) 8(-5.08,-10.541)
电机驱动
  round 1.524 hole 0.914: 1(0.254,-14.986) 2(2.794,-14.986) 3(5.334,-14.986) 4(7.874,-14.986) 5(10.414,-14.986) 6(12.954,-14.986) 7(15.494,-14.986) 8(18.034,-14.986) 9(18.034,0.254) 10(15.494,0.254) 11(12.954,0.254) 12(10.414,0.254) 13(7.874,0.254) 14(5.334,0.254) 15(2.794,0.254) 16(0.254,0.254)

## Nets
As in the schematic, except:
+3.3V: CN1.5 H1.1 H5.1 H10.17 H10.18 H10.19 H10.20 NOREF#38.1 NOREF#39.2 NOREF#42.1 NOREF#58.1 NOREF#70.1 U1.5 U1.6 U2.18 U2.40 U3.1 U4.2 U5.10 U8.1
+12V: H6.1 H6.2 H6.3 H6.4 H6.5 NOREF#24.3 NOREF#26.5 NOREF#29.2 NOREF#31.1 NOREF#35.1 NOREF#47.1 NOREF#73.2 NOREF#105.4 NOREF#116.3 R1.1 U1.3 U1.4 U5.9 U7.3 U7.4 U9.3 U9.6
GND: CN1.2 DC1.2 DC1.3 DC1.4 DC1.5 H1.2 H7.1 H7.2 H7.3 H7.4 H7.5 H9.17 H9.18 H9.19 H9.20 LED2.1 LED3.1 NOREF.1 NOREF#2.1 NOREF#3.1 NOREF#4.1 NOREF#5.1 NOREF#7.1 NOREF#8.1 NOREF#9.4 NOREF#10.1 NOREF#11.6 NOREF#12.1 NOREF#13.1 NOREF#14.1 NOREF#16.1 NOREF#18.1 NOREF#19.1 NOREF#21.1 NOREF#23.1 NOREF#25.1 NOREF#27.1 NOREF#28.5 NOREF#30.1 NOREF#33.1 NOREF#34.3 NOREF#36.1 NOREF#41.1 NOREF#43.1 NOREF#44.1 NOREF#45.1 NOREF#46.1 NOREF#48.1 NOREF#50.1 NOREF#51.1 NOREF#52.1 NOREF#53.1 NOREF#54.1 NOREF#56.1 NOREF#57.1 NOREF#61.5 NOREF#62.1 NOREF#63.1 NOREF#65.1 NOREF#66.1 NOREF#67.1 NOREF#68.1 NOREF#74.1 NOREF#75.1 NOREF#77.1 NOREF#78.6 NOREF#79.1 NOREF#80.1 NOREF#81.1 NOREF#82.1 NOREF#84.2 NOREF#86.1 NOREF#88.1 NOREF#89.8 NOREF#90.1 NOREF#92.1 NOREF#94.1 NOREF#96.1 NOREF#97.2 NOREF#98.4 NOREF#99.3 NOREF#100.1 NOREF#101.9 NOREF#102.1 NOREF#104.2 NOREF#106.1 NOREF#107.1 NOREF#108.3 NOREF#109.1 NOREF#111.1 NOREF#112.1 NOREF#113.1 NOREF#117.1 NOREF#118.1 NOREF#119.1 NOREF#120.1 NOREF#121.1 NOREF#122.1 U1.1 U1.2 U1.7 U1.8 U2.19 U2.20 U2.39 U3.2 U4.1 U5.1 U5.11 U5.16 U6.1 U7.1 U7.2 U7.7 U7.8 U8.2
MPU6050_INT: H1.6 NOREF#49.1 U3.8
MPU6050_XCL: H1.4 NOREF#17.1 U3.6
PA9: H9.10 NOREF#22.1 NOREF#83.1 NOREF#85.1 NOREF#110.1 U2.26 U8.3
PA10: H9.11 NOREF#6.1 NOREF#55.1 NOREF#60.1 NOREF#69.1 NOREF#76.1 NOREF#95.1 NOREF#114.3 U2.27 U8.4
PB1: H10.2 NOREF#15.1 U2.14 U6.7
PB8: H10.8 NOREF#37.1 NOREF#93.1 NOREF#103.1 NOREF#115.1 U2.36 U3.3 U4.3
PB9: H10.9 NOREF#32.1 U2.37 U3.4 U4.4

Pads without a net: NOREF#20 3; NOREF#40 1; NOREF#59 1; NOREF#64 1; NOREF#71 4; NOREF#72 1; NOREF#87 2; NOREF#91 1; U2 1 17 38

## Via types
v1: diameter 0.61, hole 0.305, Top Layer to Bottom Layer, 63 vias

## Routing (per net, layer and track width the routed paths; a pad name or vN(x,y) marks a point on that pad's centre or on a via; arc(x,y) is an arc through that point)
+3.3V: length 330.9
  Top Layer w0.508: 81.09,70.16 96.33,70.16 U8.1 ; U2.40 94.11,59.55 93.47,60.19 85.43,60.19 84.67,60.95 84.67,64.09 80.77,67.98 NOREF#38.1 ; 39.34,47.08 41.72,44.69 NOREF#39.2 ; U3.1 60.32,45.46 NOREF#42.1 ; 50.93,72.22 50.93,66.45 34.3,49.83 v1(34.21,49.83) ; 50.93,72.22 v1(44.07,72.22) ; 50.93,72.22 U2.18 ; H10.17 3.94,32.76 5.97,30.72 5.97,29.58 6.67,28.88 34.61,28.88 35.81,30.09 U1.5 ; H1.1 77.09,1.64 58.35,1.64 CN1.5 ; NOREF#70.1 60.32,30.85 61.47,29.71 U5.10 61.47,23.99 58.67,21.2 44.58,21.2 42.8,19.42 42.8,3.55 44.2,2.15 46.74,2.15 H5.1
  Bottom Layer w0.254: U1.6 35.86,34.61
  Bottom Layer w0.508: H10.20 H10.19 H10.18 2.7,30.25 2.7,32.79 H10.17 ; 39.34,47.08 38.54,47.87 34.93,47.87 34.21,48.58 v1(34.21,49.83) ; U2.18 50.93,74.79 51.44,75.3 79.38,75.3 80.14,74.54 80.14,70.86 NOREF#38.1 ; U4.2 28.34,74.9 28.34,73.38 29.49,72.22 v1(44.07,72.22) ; NOREF#70.1 54.1,31.99 36.37,31.99 35.86,32.5 35.86,34.61 ; U1.6 43.94,42.79 NOREF#39.2 44.7,45.46 NOREF#42.1 ; CN1.5 55.81,1.64 47.24,1.64 H5.1
+5V: length 22
  Top Layer w0.762: H8.5 H8.4 ; H8.4 35.69,8.5 U7.5 U7.6 ; H8.4 H8.3 H8.2 28.83,7.74 28.81,7.72 R2.2
+12V: length 36.9
  Top Layer w0.762: 28.83,2.15 R1.1
  Top Layer w1.016: NOREF#47.1 NOREF#29.2 NOREF#116.3 54.36,17.77 NOREF#35.1
  Top Layer w1.27: NOREF#31.1 NOREF#105.4 NOREF#24.3 ; NOREF#31.1 NOREF#26.5 NOREF#73.2 ; NOREF#31.1 NOREF#35.1
  Bottom Layer w1.016: NOREF#47.1 64.01,18.41 U5.9
MPU6050_ADO: length 87.2
  Top Layer w0.254: H1.5 87.76,3.88 90.75,6.88 90.75,38.08 86.17,42.66 49.4,42.66 48.9,43.17 U3.7
MPU6050_INT: length 89.6
  Top Layer w0.254: U3.8 46.35,44.44 48.64,42.15 85.85,42.15 90.17,37.84 NOREF#49.1
  Bottom Layer w0.254: NOREF#49.1 90.81,35.93 90.81,9.39 92.33,7.86 92.33,2.78 91.69,2.15 H1.6
MPU6050_XCL: length 93
  Top Layer w0.254: U3.6 51.44,43.93 52.07,43.3 86.36,43.3 NOREF#17.1
  Bottom Layer w0.254: NOREF#17.1 91.31,38.34 91.31,9.64 92.71,8.25 92.71,2.02 91.44,0.75 86.61,0.75 H1.4
MPU6050_XDA: length 92
  Top Layer w0.254: U3.5 53.97,44.57 54.61,43.93 86.61,43.93 91.78,38.76 91.78,1.6 91.06,0.88 83.95,0.88 H1.3
PA0: length 83.3
  Top Layer w0.254: v1(29.08,75.94) 28.93,76.09 10.19,76.09 9.02,74.92 H9.1
  Bottom Layer w0.254: U2.5 83.95,75.17 82.68,76.44 45.47,76.44 41.78,72.76 33.02,72.76 32.01,73.77 32.01,75.29 31.12,76.19 29.34,76.19 v1(29.08,75.94)
PA1: length 89.3
  Top Layer w0.254: v1(35.18,75.94) 34.93,76.19 30.35,76.19 29.59,75.43 29.59,71.49 28.96,70.86 H9.2
  Bottom Layer w0.254: v1(35.18,75.94) 36.19,76.95 83.44,76.95 85.22,75.17 85.22,72.63 84.46,71.87 82.93,71.87 U2.6
PA2: length 73.2
  Bottom Layer w0.254: U2.7 77.72,74.55 65.79,74.55 64.9,73.65 64.9,73.14 62.66,70.91 12.88,70.91 10.29,68.32 H9.3
PA3: length 146.5
  Top Layer w0.254: v1(66.53,48.17) 66.53,52.49 69.83,55.79 69.83,60.87 67.87,62.83 64.58,62.83 62.08,65.32 v1(62.08,70.27) ; v1(67.04,13.24) 65.39,11.59 60.15,11.59 U5.6 ; v1(65.91,72.13) 71.75,72.13 72.4,72.77 72.4,74.04 73.41,75.05 75.82,75.05 76.33,74.54 U2.8
  Bottom Layer w0.254: v1(65.91,72.13) 64.05,70.27 v1(62.08,70.27) 61.88,70.47 13.72,70.47 H9.4 ; v1(67.04,13.24) 66.73,13.55 66.73,47.97 v1(66.53,48.17)
PA4: length 140
  Top Layer w0.254: 68.14,71.62 72.01,71.62 U2.9 ; 68.14,71.62 66.93,71.62 v1(66.29,70.98) ; 68.14,71.62 v1(68.14,70.86) ; v1(66.87,61.71) 67.37,61.2 67.37,56.31 63.25,52.19 58.55,52.19 57.98,51.62 57.98,47.61 v1(54.96,44.6) ; H9.5 34.67,63.24 34.93,63.49 42.8,63.49 v1(48.9,69.59)
  Bottom Layer w0.254: v1(68.14,70.86) 68.14,62.98 v1(66.87,61.71) ; v1(48.9,69.59) 64.9,69.59 v1(66.29,70.98) ; U5.7 61.47,26.34 62.55,27.42 62.55,30.98 54.96,38.56 v1(54.96,44.6)
PA5: length 68.3
  Top Layer w0.254: H9.6 33.66,60.7 35.45,62.49 43.83,62.49 v1(50.16,68.82) ; v1(66.77,70.19) 66.87,70.09 69.22,70.09 v1(69.98,70.86)
  Bottom Layer w0.254: v1(66.77,70.19) 65.41,68.82 v1(50.16,68.82) ; v1(69.98,70.86) 69.98,72.13 U2.10
PA6: length 141.8
  Top Layer w0.254: v1(67.33,49.77) 67.33,52.57 70.26,55.5 ; H9.7 11.1,60.24 36.21,60.24 v1(36.85,60.89) ; v1(72.28,60.06) 70.89,61.46 v1(70.89,61.84)
  Bottom Layer w0.254: CN1.4 65.95,9.27 65.95,48.41 66.29,48.75 66.31,48.75 v1(67.33,49.77) ; U2.11 68.71,71.11 68.79,71.03 68.79,70.36 68.71,70.28 68.71,64.02 v1(70.89,61.84) 68.07,61.84 67.36,61.13 62.03,61.13 61.34,60.44 37.72,60.44 37.27,60.89 v1(36.85,60.89) ; v1(72.28,60.06) 72.52,59.83 72.52,56.25 72.01,55.74 v1(70.5,55.74)
PA7: length 134.1
  Top Layer w0.254: v1(47.75,54.35) 48.46,55.06 63.68,55.06 v1(64.01,54.73) 65.04,55.76 65.04,61.7 v1(65.02,61.71)
  Bottom Layer w0.254: v1(47.75,54.35) 47.37,53.97 12.83,53.97 11.18,55.62 H9.8 ; v1(64.01,54.73) 64.01,54.6 69.58,49.02 69.58,10.41 CN1.3 ; U2.12 67.44,72.13 67.44,64.12 v1(65.02,61.71)
PA8: length 106.5
  Top Layer w0.254: v1(50.67,56.25) 51.31,56.89 56.01,56.89 56.01,57.01 ; U2.25 55.72,57.87 56.01,57.59 56.01,57.01 ; v1(54.71,46.44) 54.71,48.23 55.09,48.61 v1(55.09,50.64) ; v1(59.28,55.97) 58.36,56.89 56.13,56.89 56.01,57.01
  Bottom Layer w0.254: v1(50.67,56.25) 47.87,53.45 9.39,53.45 H9.9 ; v1(55.09,50.64) 55.09,51.78 v1(59.28,55.97) ; v1(54.71,46.44) 54.96,46.19 59.59,46.19 60.08,45.7 60.08,34.47 65.41,29.14 65.41,14.21 U5.8
PA9: length 97.4
  Top Layer w0.254: 70.1,64.76 NOREF#110.1 65.28,64.63 ; NOREF#22.1 59.69,60.57 58.55,59.43 U2.26 ; NOREF#83.1 U8.3
  Bottom Layer w0.254: NOREF#85.1 72.64,62.35 84.33,62.35 86.61,64.63 NOREF#83.1 ; U2.26 53.49,53.1 12.97,53.1 10.41,50.54 H9.10 ; 65.28,64.63 64.92,64.63 63.03,62.75 60.34,62.75 NOREF#22.1
PA10: length 99.1
  Top Layer w0.254: NOREF#114.3 55.42,51.62 56.32,51.62 57.15,52.44 ; NOREF#55.1 70.23,63.62 NOREF#69.1 ; v1(32,49.01) 31.24,48.25 9.27,48.25 H9.11 ; NOREF#95.1 61.09,61.84 U2.27 61.09,58.03 NOREF#76.1 ; U8.4 96.65,61.97 NOREF#60.1
  Bottom Layer w0.254: v1(32,49.01) 33.99,51 53.15,51 NOREF#114.3 ; 57.15,52.44 57.28,52.44 59.94,55.11 NOREF#76.1 ; NOREF#69.1 72.14,61.71 85.72,61.71 NOREF#60.1 ; NOREF#95.1 63.37,62.09 64.9,63.62 NOREF#55.1
PA11: length 61.8
  Top Layer w0.254: v1(60.32,54.47) 53.97,54.47 52.14,52.64 42.36,52.64 36.97,47.25 10.81,47.25 H9.12 ; v1(64.01,55.74) 64.01,56.38 63.63,56.76 U2.28
  Bottom Layer w0.254: v1(60.32,54.47) 62.74,54.47 v1(64.01,55.74)
PA12: length 64.8
  Top Layer w0.254: H9.13 12.61,46.51 36.99,46.51 42.42,51.93 52.45,51.93 54.36,53.84 64.13,53.84 66.17,55.87 U2.29
PA15: length 68.3
  Top Layer w0.254: U2.30 68.13,57.58 68.13,56.19 63.5,51.55 v1(58.93,51.55)
  Bottom Layer w0.254: v1(58.93,51.55) 57.28,51.55 55.25,49.52 55.25,48.76 54.05,47.56 42.87,47.56 35.69,40.38 H9.14
PB0: length 100.4
  Top Layer w0.254: 63.63,71.62 63.63,70.22 64.39,69.46 69.22,69.46 75.06,63.62 75.06,53.24 v1(75.26,53.03) ; 63.63,71.62 60.71,71.62 59.82,72.51 59.82,75.68 58.17,77.33 10.41,77.33 6.48,73.4 H10.1 ; 63.63,71.62 U2.13
  Bottom Layer w0.254: v1(75.26,53.03) 75.26,48.04 U6.8
PB1: length 151.3
  Top Layer w0.254: 61.09,75.94 61.09,76.06 58.93,78.22 10.29,78.22 6.6,74.54 ; 61.09,75.94 61.21,76.06 94.87,76.06 98.81,72.13 98.81,49.14 95,45.33 79.25,45.33 78.23,46.34 U6.7 ; 61.09,75.94 U2.14
  Bottom Layer w0.254: H10.2 2.92,70.86 6.6,74.54
PB3: length 94.8
  Top Layer w0.254: U2.31 71.25,50.92 72.77,49.39 80.39,49.39 80.77,49.01 U6.6 ; v1(62.36,60.01) v1(62.36,58.16)
  Bottom Layer w0.254: U2.31 71.25,57.27 70.89,56.91 63.35,56.91 62.36,57.9 v1(62.36,58.16) ; v1(62.36,60.01) 48.81,60.01 48.79,60.04 11.71,60.04 9.78,61.97 8.51,61.97 2.67,67.81 H10.3
PB4: length 104.2
  Top Layer w0.254: U6.5 83.31,50.16 83.06,50.41 v1(77.09,50.41) 74.93,50.41 73.79,51.55 U2.32 72.52,59.43 v1(71.5,59.43)
  Bottom Layer w0.254: H10.4 2.67,65.27 8.51,59.43 9.78,59.43 10.03,59.68 48.64,59.68 48.9,59.43 v1(71.5,59.43) ; U6.5 82.17,46.47 77.85,46.47 77.09,47.23 v1(77.09,50.41)
PB5: length 125.3
  Top Layer w0.254: v1(84.84,49.65) 84.84,48.63 U6.4 85.85,50.74 85.67,50.92 77.73,50.92 76.33,52.32 U2.33 ; v1(65.28,67.3) 70.36,67.3 73.53,64.12 v1(73.53,59.81) ; v1(35.18,67.05) 8.64,67.05 4.83,63.24 H10.5
  Bottom Layer w0.254: v1(35.18,67.05) 35.89,67.76 62.09,67.76 62.55,67.3 v1(65.28,67.3) ; v1(73.53,59.81) 74.68,59.81 U2.33 77.6,56.89 81.66,56.89 82.56,57.78 82.56,59.44 83.06,59.93 84.58,59.93 85.1,59.42 85.1,49.91 v1(84.84,49.65)
PB6: length 124.2
  Top Layer w0.254: H10.6 4.19,60.7 7.37,63.87 v1(7.37,64.51) ; v1(61.98,64.51) 64.01,62.47 67.18,62.47 68.83,60.82 v1(68.83,60.62) ; U6.3 88.39,51.3 88.14,51.55 80.01,51.55 78.87,52.69 U2.34 78.87,59.3 79.5,59.93 82.04,59.93 82.77,59.2 82.77,56.03 83.66,55.14 v1(88.99,55.14)
  Bottom Layer w0.254: v1(88.99,55.14) 88.99,48.22 U6.3 ; v1(7.37,64.51) v1(61.98,64.51) ; U2.34 78.87,59.68 77.9,60.64 77.88,60.62 72.55,60.62 72.53,60.64 72.04,60.64 72.02,60.62 v1(68.83,60.62)
PB7: length 107.5
  Top Layer w0.254: U2.35 81.41,53.2 82.3,52.31 88.77,52.31 90.93,50.16 U6.2 ; v1(64.39,60.44) 64.39,61.08 61.47,64 49.91,64 v1(42.16,56.25)
  Bottom Layer w0.254: v1(42.16,56.25) 40.64,56.25 37.85,59.05 11.68,59.05 9.53,56.89 8.51,56.89 7.24,58.16 H10.7 ; U2.35 81.41,60.31 80.52,61.2 68.2,61.2 67.44,60.44 v1(64.39,60.44)
PB8: length 137.7
  Top Layer w0.254: H10.8 1.4,56.89 1.4,63.74 2.16,64.51 3.17,64.51 8.45,69.78 28.38,69.78 30.64,72.04 30.64,74.96 U4.3 ; U3.3 59.06,50.66 59.56,51.17 64.05,51.17 v1(67.9,55.02) ; NOREF#115.1 79.88,68.19 83.95,64.12 U2.36 ; NOREF#93.1 NOREF#103.1
  Bottom Layer w0.254: 28.32,69.71 47.37,69.71 48.91,68.17 65.68,68.17 65.79,68.06 ; v1(67.9,55.02) 68.03,55.15 80.94,55.15 U2.36 ; NOREF#115.1 NOREF#93.1
PB9: length 170.2
  Top Layer w0.254: v1(37.85,46.09) 42.42,41.52 NOREF#32.1 v1(73.53,41.52)
  Bottom Layer w0.254: U4.4 33.27,76.44 32.87,76.85 17.04,76.85 9.78,69.59 2.16,69.59 1.4,68.82 1.4,54.35 H10.9 6.1,53.08 7.62,51.55 7.62,47.76 8.66,46.73 37.21,46.73 v1(37.85,46.09) ; U2.37 86.49,50.16 84.71,48.38 84.71,45.5 80.24,41.03 74.02,41.03 v1(73.53,41.52) ; NOREF#32.1 64.52,42.28 60.07,46.73 57.4,46.73 56.51,47.61 U3.4
PB10: length 72.1
  Top Layer w0.254: H10.10 4.32,50.54 4.95,51.17 4.95,60.95 8.51,64.51 35.18,64.51 45.34,74.67 57.28,74.67 U2.15
PB11: length 70.9
  Top Layer w0.254: v1(49.53,71.49) 49.53,69.2 43.31,62.98 35.18,62.98 34.16,61.97 8.51,61.97 5.36,58.82 5.36,49.04 4.32,48 H10.11
  Bottom Layer w0.254: v1(49.53,71.49) 54.1,71.49 U2.16
PB12: length 48.4
  Top Layer w0.254: H10.12 7.11,45.46 8.38,46.73 8.84,46.73 8.86,46.75 9.55,46.75 10.54,47.74 35.43,47.74 U2.21
PB13: length 56.9
  Top Layer w0.254: H10.13 1.4,44.19 1.4,45.96 2.16,46.73 2.49,46.73 2.51,46.75 5.61,46.75 8.13,49.27 8.84,49.27 8.86,49.29 9.55,49.29 14.02,53.76 37.13,53.76 v1(41.53,58.16)
  Bottom Layer w0.254: U2.22 47.35,59.2 41.81,59.2 41.53,58.92 v1(41.53,58.16)
PB14: length 60.1
  Top Layer w0.254: v1(5.84,48.25) 5.84,49.52 8,51.68 11.3,51.68 13.74,54.11 36.85,54.11 40.13,57.39 v1(40.13,57.78)
  Bottom Layer w0.254: U2.23 49.66,56.89 42.96,56.89 42.66,57.19 42.24,57.19 42.18,57.24 40.66,57.24 v1(40.13,57.78) ; H10.14 4.46,42.17 4.46,46.87 v1(5.84,48.25)
PB15: length 65.8
  Top Layer w0.254: v1(52.71,54.22) 51.6,53.11 41.82,53.11 v1(38.86,50.16)
  Bottom Layer w0.254: v1(38.86,50.16) 38.86,48.76 40.13,47.49 40.13,45.71 38.61,44.19 8.51,44.19 2.67,38.34 H10.15 ; U2.24 53.47,54.98 v1(52.71,54.22)
PC13: length 173.8
  Top Layer w0.254: v1(70.17,40.17) 69.96,40.38 48.51,40.38 38.8,30.66 v1(38.8,16.82) ; v1(25.78,30.85) 25.78,34.28 23.37,36.69 13.72,36.69 v1(12.57,37.84)
  Bottom Layer w0.254: v1(70.17,40.17) 70.6,39.74 91.82,39.74 96.27,44.19 96.27,59.05 95,60.31 92.46,60.31 91.63,61.14 91.63,73.33 U2.2 ; H5.3 46.86,8.75 45.72,9.9 39.75,9.9 38.8,10.85 v1(38.8,16.82) 38.74,16.88 28.32,16.88 25.78,19.42 v1(25.78,30.85) ; v1(12.57,37.84) H9.15
PC14: length 124.8
  Top Layer w0.254: v1(71.75,40.76) 71.58,40.94 14.66,40.94 H9.16
  Bottom Layer w0.254: U2.3 89.03,61.71 90.93,59.81 94.74,59.81 95.78,58.77 95.78,44.85 91.31,40.38 72.14,40.38 v1(71.75,40.76)
PC15: length 127.7
  Bottom Layer w0.254: H10.16 0.89,37.07 0.89,70.86 2.16,72.13 3.39,72.13 8.85,77.59 84.46,77.59 86.49,75.56 U2.4
TB6612_AIN1: length 33.9
  Top Layer w0.254: U5.4 53.85,10.78 54.36,10.28 80.9,10.28 82.55,8.63 H4.3
TB6612_AIN2: length 33.8
  Top Layer w0.254: U5.3 51.31,11.17 53.21,9.26 79.5,9.26 80.01,8.75 H4.2
TB6612_AO1: length 31.7
  Top Layer w0.254: CN1.1 64.39,5.6 60.83,5.6 v1(59.08,7.36)
  Bottom Layer w0.254: U5.12 56.39,14.85 57.78,13.45 57.78,8.65 v1(59.08,7.36)
TB6612_AO2: length 29.6
  Top Layer w0.254: CN1.6 54.58,3.16 v1(50.01,7.74)
  Bottom Layer w0.254: U5.13 53.34,27.55 53.34,14.98 52.58,14.21 52.58,8.63 51.69,7.74 v1(50.01,7.74)
TB6612_OUT1: length 72.5
  Top Layer w0.254: H4.4 85.22,6.21 85.22,5.32 85.4,5.14 88.52,5.14 89.31,5.93 89.31,7.61 84.07,12.84 84.07,30.72 81.79,33.01 50.8,33.01 48.77,30.98 U5.15
TB6612_OUT2: length 62.2
  Top Layer w0.254: U5.14 51.31,30.85 52.96,32.5 81.28,32.5 83.31,30.47 83.31,12.56 87.63,8.25 H4.5
TB6612_PWMB: length 33.6
  Top Layer w0.254: U5.2 48.77,10.53 50.93,8.37 76.96,8.37 77.47,7.86 H4.1
TB6612_STBY: length 16.6
  Bottom Layer w0.254: U5.5 56.39,6.59 54.36,4.56 H5.2
$1N9714: length 2.5
  Top Layer w0.762: R2.1 22.93,7.72 LED2.2
$1N10386: length 2.5
  Top Layer w0.254: 20.66,2.15 20.36,2.15
  Top Layer w0.762: R1.2 20.66,2.15

## Copper pours and planes (outline as drawn; the poured copper is in the pictures)
+12V on Bottom Layer: 11.3,9.01 16.76,9.01 16.76,0.62 11.3,0.62
+12V on Bottom Layer: 40,15.89 52.32,15.89 52.32,14.59 40,14.59
+12V on Bottom Layer: 16.25,11.29 40.26,11.29 40.26,0.62 16.25,0.62
+12V on Bottom Layer: 15.49,36.06 24.51,36.06 24.51,11.17 15.49,11.17
+12V on Bottom Layer: 23.11,36.06 52.32,36.06 52.32,15.48 23.11,15.48
+12V on Bottom Layer: 27.43,27.93 34.04,27.93 34.04,18.66 27.43,18.66
GND on Top Layer: -1.52,82.54 102.11,82.54 102.11,-0.77 -1.52,-0.77
GND on Bottom Layer: -5.59,89.65 109.35,89.65 109.35,-4.84 -5.59,-4.84
GND on Bottom Layer: -4.32,84.44 128.14,84.44 128.14,-15 -4.32,-15
IN+12V on Bottom Layer: 4.83,19.68 14.73,19.68 14.73,0.75 4.83,0.75

Small or netless copper shapes (teardrops, artwork), in the pictures only: 185 on Top Layer, 148 on Bottom Layer

## Text on the board
Top Silkscreen Layer: A0 | A1 | A2 | A3 | A4 | A5 | A6 | A7 | A8 | A9 | A10 | A11 | A12 | A15 | GND | G | V | C | D | +5V | 12V | IN | AD | C13 | EN | XL | XD | E1 | E2 | VM | RST | PWM | SET | I2 | M | I1 | R | O1 | L | O2 | U | COM | VB | C15 | B3 | B4 | B5 | B6 | B7 | B8 | B9 | B10 | B11 | B12 | B13 | B14 | B15 | C14 | TX | RX | +3.3 / V | B0 | B1
